# Altium schematic sheet PowerSupp.SchDoc
size A3
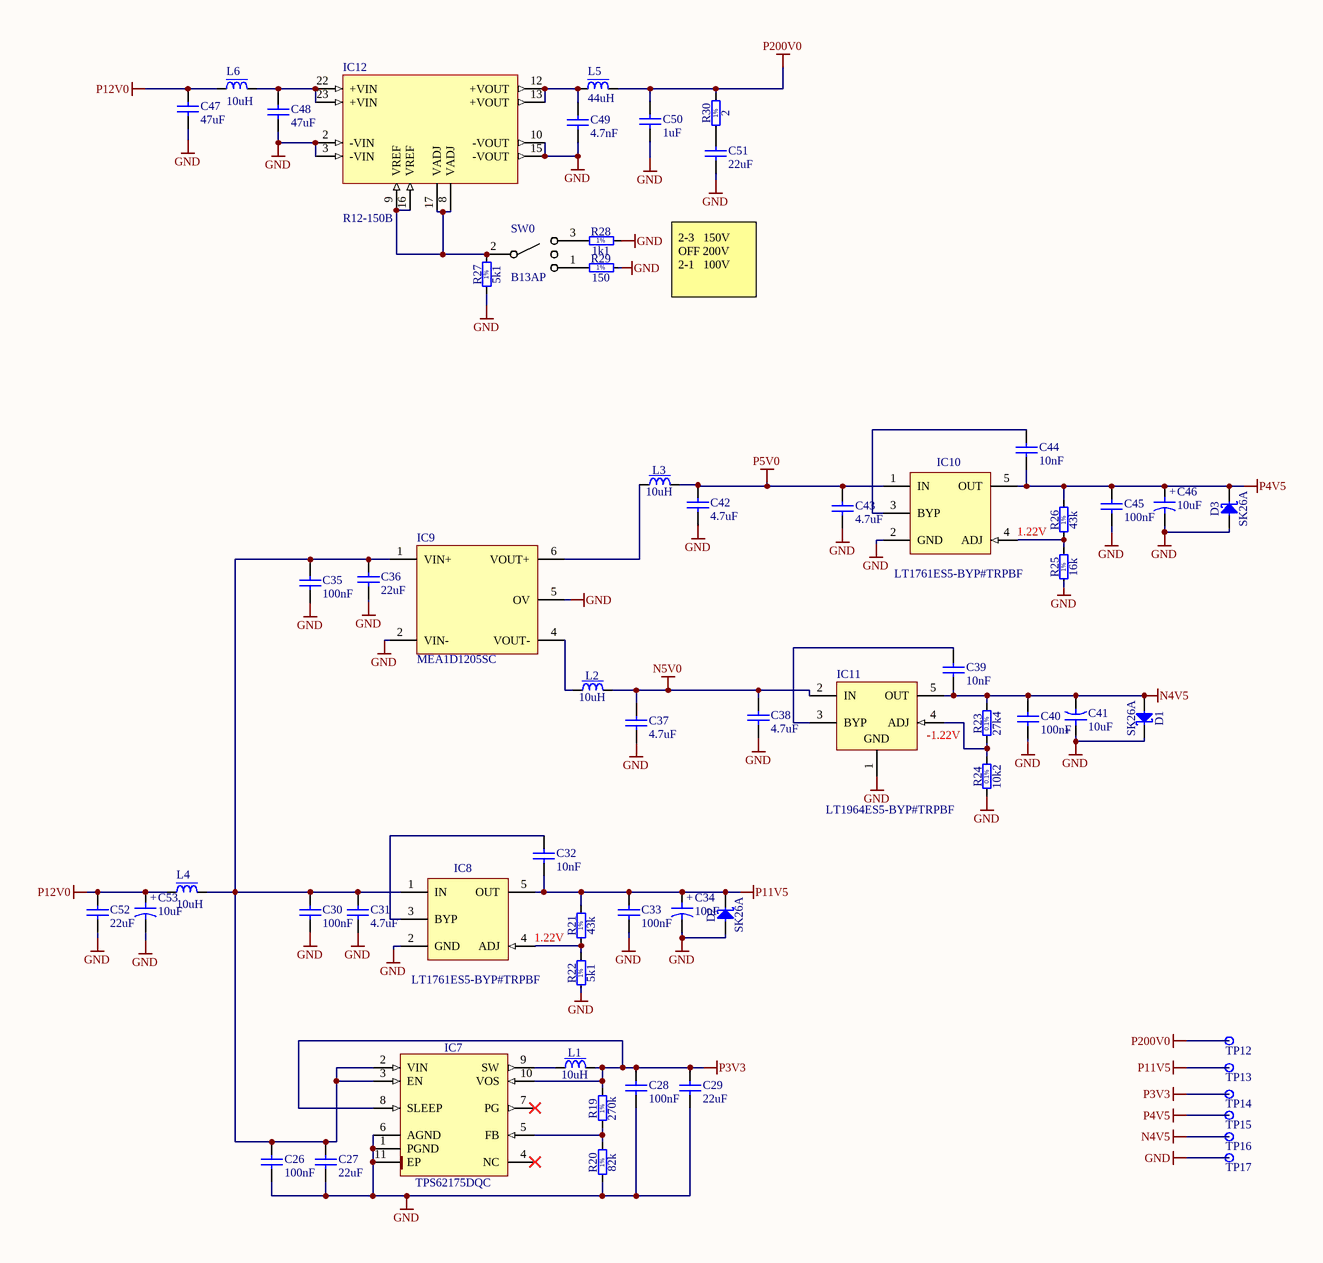
[diagram p0: PowerSupp.SchDoc]

## Parts
C26  100nF  [C0402C104K4RACTU]
C27  22uF  [GRM219R61C226ME15K]
C28  100nF  [C0402C104K4RACTU]
C29  22uF  [GRM219R61C226ME15K]
C30  100nF  [C0402C104K4RACTU]
C31  4.7uF  [C0805C475K4RACTU]
C32  10nF  [C0402C103K4RACTU]
C33  100nF  [C0402C104K4RACTU]
C34  10uF  [TCJT106M016R0200]
C35  100nF  [C0402C104K4RACTU]
C36  22uF  [GRM219R61C226ME15K]
C37  4.7uF  [C0805C475K4RACTU]
C38  4.7uF  [C0805C475K4RACTU]
C39  10nF  [C0402C103K4RACTU]
C40  100nF  [C0402C104K4RACTU]
C41  10uF  [TCJT106M016R0200]
C42  4.7uF  [C0805C475K4RACTU]
C43  4.7uF  [C0805C475K4RACTU]
C44  10nF  [C0402C103K4RACTU]
C45  100nF  [C0402C104K4RACTU]
C46  10uF  [TCJT106M016R0200]
C47  47uF  [C5750X7R1C476M230KB]
C48  47uF  [C5750X7R1C476M230KB]
C49  4.7nF  [CC0805KRX7RYBB472]
C50  1uF  [GC355XD72E105KX05L]
C51  22uF  [R60IR52205000K]
C52  22uF  [GRM219R61C226ME15K]
C53  10uF  [TCJT106M016R0200]
D1  SK26A  [DIOM5126X265N]
D2  SK26A  [DIOM5126X265N]
D3  SK26A  [DIOM5126X265N]
IC7  TPS62175DQC  [SON50P200X300X80-11N-R94X250]
IC8  LT1761ES5-BYP#TRPBF  [LT-S5-5-TSOT-23_L]
IC9  MEA1D1205SC  [MURA-SIP-5_V]
IC10  LT1761ES5-BYP#TRPBF  [LT-S5-5-TSOT-23_L]
IC11  LT1964ES5-BYP#TRPBF  [LT-S5-5-TSOT-23_L]
IC12  R12-150B  [CONV_R12-100B]
L1  10uH  [IND_MURATA-PS_8400]
L2  10uH  [IND_MURATA-PS_8400]
L3  10uH  [IND_MURATA-PS_8400]
L4  10uH  [IND_MURATA-PS_8400]
L5  44uH  [LQH44PH100MPRL]
L6  10uH  [IND_MURATA-PS_8400]
R19  270k  [RESC1608X55N]
R20  82k  [RESC1608X55N]
R21  43k  [RESC1608X55N]
R22  5k1  [RESC1608X55N]
R23  27k4  [RESC1608X55N]
R24  10k2  [RESC1608X55N]
R25  16k  [RESC1608X55N]
R26  43k  [RESC1608X55N]
R27  5k1  [RESC1608X55N]
R28  1k1  [RESC1608X55N]
R29  150  [RESC1608X55N]
R30  2  [RESC3216X65N]
SW0  B13AP  [B13AP]
TP12  Test Point  [TPS127]  (value not drawn)
TP13  Test Point  [TPS127]  (value not drawn)
TP14  Test Point  [TPS127]  (value not drawn)
TP15  Test Point  [TPS127]  (value not drawn)
TP16  Test Point  [TPS127]  (value not drawn)
TP17  Test Point  [TPS127]  (value not drawn)

## Nets
GND: C26.1 C27.1 C28.1 C29.1 C30.1 C31.1 C33.1 C34.2 C35.1 C36.1 C37.1 C38.1 C40.1 C41.1 C42.1 C43.1 C45.1 C46.2 C47.1 C48.1 C49.1 C50.1 C51.1 C52.1 C53.2 D1.1(C) D2.2(A) D3.2(A) IC7.1(PGND) IC7.6(AGND) IC7.11(EP) IC8.2(GND) IC9.2(VIN-) IC9.5(OV) IC10.2(GND) IC11.1(GND) IC12.2(-VIN) IC12.3(-VIN) IC12.10(-VOUT) IC12.15(-VOUT) R20.1 R22.1 R24.1 R25.1 R27.1 R28.2 R29.2 TP17.1
N4V5: C39.1 C40.2 C41.2 D1.2(A) IC11.5(OUT) R23.2 TP16.1
N5V0: C37.2 C38.2 IC11.2(IN) L2.2
P3V3: C28.2 C29.2 IC7.8(SLEEP) IC7.10(VOS) L1.2 R19.2 TP14.1
P4V5: C44.1 C45.2 C46.1 D3.1(C) IC10.5(OUT) R26.2 TP15.1
P5V0: C42.2 C43.2 IC10.1(IN) L3.2
P11V5: C32.1 C33.2 C34.1 D2.1(C) IC8.5(OUT) R21.2 TP13.1
P12V0: C47.2 C52.2 C53.1 L4.1 L6.1
P200V0: C50.2 L5.2 R30.2 TP12.1
NetC26_2: C26.2 C27.2 C30.2 C31.2 C35.2 C36.2 IC7.2(VIN) IC7.3(EN) IC8.1(IN) IC9.1(VIN+) L4.2
NetC32_2: C32.2 IC8.3(BYP)
NetC39_2: C39.2 IC11.3(BYP)
NetC44_2: C44.2 IC10.3(BYP)
NetC48_2: C48.2 IC12.22(+VIN) IC12.23(+VIN) L6.2
NetC49_2: C49.2 IC12.12(+VOUT) IC12.13(+VOUT) L5.1
NetC51_2: C51.2 R30.1
NetIC7_5: IC7.5(FB) R19.1 R20.2
NetIC7_9: IC7.9(SW) L1.1
NetIC8_4: IC8.4(ADJ) R21.1 R22.2
NetIC9_4: IC9.4(VOUT-) L2.1
NetIC9_6: IC9.6(VOUT+) L3.1
NetIC10_4: IC10.4(ADJ) R25.2 R26.1
NetIC11_4: IC11.4(ADJ) R23.1 R24.2
NetIC12_8: IC12.8(VADJ) IC12.9(VREF) IC12.16(VREF) IC12.17(VADJ) R27.2 SW0.2(C)
NetR28_1: R28.1 SW0.3(NC)
NetR29_1: R29.1 SW0.1(NO)

Not connected (* = marked no-connect by the designer): IC7 4(NC)* 7(PG)*

## Notes on the sheet
- 2-3   150V OFF 200V  2-1   100V
- 1.22V
- (near IC11) -1.22V
- (in symbol R0603_1K1_1%_0.1W_100PPM) 1%
- (in symbol R0603_5K1_1%_0.1W_100PPM) 1%
- (in symbol R0603_10K2_0.1%_0.063W_10PPM) 0.1%
- (in symbol R0603_16K_1%_0.1W_100PPM) 1%
- (in symbol R0603_27K4_0.1%_0.063W_10PPM) 0.1%
- (in symbol R0603_43K_1%_0.1W_100PPM) 1%
- (in symbol R0603_82K_1%_0.1W_100PPM) 1%
- (in symbol R0603_150R_1%_0.1W_100PPM) 1%
- (in symbol R0603_270K_1%_0.1W_100PPM) 1%
- (in symbol R1206_2R_1%_0.25W_200PPM) 1%
- (in symbol TCJT106M016R0200) +

## Library data of the parts
C26 C28 C30 C33 C35 C40 C45 = C0402C104K4RACTU: Capacitor; Ceramic; Cap; .100uF; Tol 10%; SMT; Vol-Rtg 16V; X7R; Tape and Reel; Manufacturer 1: KEMET; Dissipation Factor: 3.5%; Supplier 1: Digi-Key; Manufacturer Part Number 1: C0402C104K4RACTU; Stock 1: 636137; Pricing 1: 1=0,10000, 10=0,04000, 50=0,02180, 100=0,01780, 500=0,01270, 1000=0,00998, 2500=0,00908, 5000=0,00835 (USD); RoHS: Yes; Mount: Surface Mount; Case/Package: 0402; Case Code (Imperial): 0402; Case Code (Metric): 1005; Contact Plating: Tin,Matte; Min Operating Temperature: -55°C; Max Operating Temperature: 125°C; Capacitance: 100nF; Tolerance: 10%; Packaging: Tape and Reel; Voltage Rating (DC): 16V; Dielectric: X7R; Package Quantity: 10000; Voltage Rating: 16V; Termination: SMD/SMT; Length: 1mm; Height: 0.5mm; Width: 0.5mm; Depth: 0.5mm; Radiation Hardening: No; ComponentLink1URL: https://datasheet.ciiva.com/45846/docfinderpartnumberc0402c102k5ractu-45846919.pdf?src-supplier=Onlinecomponents.com; ComponentLink1Description: https://datasheet.ciiva.com/45846/docfinderpartnumberc0402c102k5ractu-45846919.pdf?src-supplier=Onlinecomponents.com; ComponentLink2URL: https://datasheet.ciiva.com/18192/getdatasheetpartid-385384-18192412.pdf?src-supplier=Verical; ComponentLink2Description: https://datasheet.ciiva.com/18192/getdatasheetpartid-385384-18192412.pdf?src-supplier=Verical; Supplier Part Number 1: 399-3521-1-ND
C27 C29 C36 C52 = GRM219R61C226ME15K: CAP CER 22uF 16V X5R 20% SMD 0805 85°C Embossed T/R; Manufacturer 1: Murata; Supplier 1: Digi-Key; Manufacturer Part Number 1: GRM219R61C226ME15K; Stock 1: 9158; Pricing 1: 1=0,46000, 10=0,32500, 50=0,24560, 100=0,21400, 500=0,15852, 1000=0,13473, 2500=0,12681, 5000=0,11888 (USD); RoHS: No; Voltage Rating (DC): 16V; Dielectric: X5R; Tolerance: 20%; Capacitance: 22uF; Length: 2mm; Width: 1.25mm; Thickness: 850um; Supplier Part Number 1: 490-GRM219R61C226ME15KCT-ND
C31 C37 C38 C42 C43 = C0805C475K4RACTU: CAP CER 4.7uF 16V X7R 10% Pad SMD 0805 125C T/R; Manufacturer 1: KEMET; Dielectric Material: Ceramic; Dissipation Factor: 5%; Supplier 1: Digi-Key; Manufacturer Part Number 1: C0805C475K4RACTU; Stock 1: 75020; Pricing 1: 1=0,25000, 10=0,16900, 50=0,11280, 100=0,09590, 500=0,06766, 1000=0,05921 (USD); RoHS: Yes; Mount: Surface Mount; Case/Package: 0805; Case Code (Metric): 2012; Case Code (Imperial): 0805; Min Operating Temperature: -55°C; Max Operating Temperature: 125°C; Packaging: Tape and Reel; Capacitance: 4.7uF; Tolerance: 10%; Voltage Rating: 16V; Package Quantity: 1; Voltage Rating (DC): 16V; Dielectric: X7R; Termination: SMD/SMT; Voltage: 16V; Length: 2mm; Height: 1.25mm; Width: 0.049inch; Thickness: 0.055inch; Depth: 1.25mm; REACH SVHC: No SVHC; ComponentLink1URL: https://datasheet.ciiva.com/5408/kem-c1002-x7r-smd-5408584.pdf?src-supplier=Mouser; ComponentLink1Description: https://datasheet.ciiva.com/5408/kem-c1002-x7r-smd-5408584.pdf?src-supplier=Mouser; ComponentLink2URL: https://datasheet.ciiva.com/28682/1851736-28682348.pdf?src-supplier=Element14; ComponentLink2Description: https://datasheet.ciiva.com/28682/1851736-28682348.pdf?src-supplier=Element14; Supplier Part Number 1: 399-7415-1-ND
C32 C39 C44 = C0402C103K4RACTU: CAP CER 10nF 16V X7R 10% SMD 0402 125C Paper T/R; Manufacturer 1: KEMET; Dielectric Material: Ceramic; Dissipation Factor: 3.5%; Supplier 1: Digi-Key; Manufacturer Part Number 1: C0402C103K4RACTU; Stock 1: 1553319; Pricing 1: 1=0,10000, 10=0,02700, 50=0,01460, 100=0,01190, 500=0,00848, 1000=0,00666, 2500=0,00605, 5000=0,00557 (USD); RoHS: Yes; Mount: Surface Mount,PCB; Case/Package: 0402; Number of Pins: 2; Case Code (Metric): 1005; Case Code (Imperial): 0402; Contact Plating: Tin,Matte; Min Operating Temperature: -55°C; Max Operating Temperature: 125°C; Package Quantity: 1; Capacitance: 10nF; Voltage Rating: 16V; Tolerance: 10%; Packaging: Tape and Reel; Voltage Rating (DC): 16V; Dielectric: X7R; Termination: SMD/SMT; Voltage: 16V; Length: 1mm; Height: 0.5mm; Width: 0.02inch; Lead Pitch: 0.3mm; Thickness: 0.022inch; Depth: 0.5mm; Radiation Hardening: No; REACH SVHC: No SVHC; ComponentLink1URL: https://datasheet.ciiva.com/14595/70095383-14595321.pdf?src-supplier=Allied+Electronics; ComponentLink1Description: https://datasheet.ciiva.com/14595/70095383-14595321.pdf?src-supplier=Allied+Electronics; ComponentLink2URL: https://datasheet.ciiva.com/7747/kem-c1002-x7r-smd-7747614.pdf?src-supplier=Element14; ComponentLink2Description: https://datasheet.ciiva.com/7747/kem-c1002-x7r-smd-7747614.pdf?src-supplier=Element14; Supplier Part Number 1: 399-1038-1-ND
C34 C41 C46 C53 = TCJT106M016R0200: CAP TANT POLY 10UF 16V 1210; Manufacturer 1: Kyocera AVX; Tolerance: 20%; ESR (Equivalent Series Resistance): 200mR; Leakage Current: 16uA; Dissipation Factor: 6%; Supplier 1: Digi-Key; Manufacturer Part Number 1: TCJT106M016R0200; Stock 1: 1486; Pricing 1: 1=0,85000, 10=0,62700, 50=0,50140, 100=0,42980, 500=0,34026, 1000=0,28653 (USD); RoHS: Yes; Mount: Surface Mount; Case/Package: 1210; Case Code (Imperial): 1210; Case Code (Metric): 3528; Min Operating Temperature: -55°C; Max Operating Temperature: 125°C; Capacitance: 10uF; Termination: SMD/SMT; Voltage: 16V; Packaging: Tape and Reel; Package Quantity: 2500; Voltage Rating (DC): 16V; Voltage Rating: 16V; Length: 3.5mm; Height: 1.2mm; Depth: 2.8mm; Height - Seated (Max): 0.047inch; Width: 2.8mm; Radiation Hardening: No; ComponentLink1URL: https://datasheet.ciiva.com/11793/0900766b80eff593-11793120.pdf?src-supplier=RSComponents; ComponentLink1Description: https://datasheet.ciiva.com/11793/0900766b80eff593-11793120.pdf?src-supplier=RSComponents; ComponentLink2URL: https://datasheet.ciiva.com/6238/tcj-6238575.pdf?src-supplier=Digi-Key; ComponentLink2Description: https://datasheet.ciiva.com/6238/tcj-6238575.pdf?src-supplier=Digi-Key; ComponentLink3URL: https://datasheet.ciiva.com/11231/tcj-11231109.pdf?src-supplier=Avnet; ComponentLink3Description: https://datasheet.ciiva.com/11231/tcj-11231109.pdf?src-supplier=Avnet; Supplier Part Number 1: 478-11587-1-ND
C47 C48 = C5750X7R1C476M230KB: CAP CER 47 F, 16 V,  20%, X7R, C Series, 2220 [5650 Metric]; Manufacturer 1: TDK; Dielectric Material: Ceramic; Voltage Rating (DC): 16V; Supplier 1: Digi-Key; Manufacturer Part Number 1: C5750X7R1C476M230KB; Stock 1: 2641; Pricing 1: 1=2,47000, 10=1,99700, 50=1,74240, 100=1,52460 (USD); RoHS: Yes; Mount: Surface Mount; Case/Package: 2220; Number of Pins: 2; Weight: 0.016932oz; Case Code (Imperial): 2220; Case Code (Metric): 5750; Min Operating Temperature: -55°C; Max Operating Temperature: 125°C; Dielectric: X7R; Tolerance: 20%; Capacitance: 47uF; Termination: SMD/SMT; Packaging: Tape and Reel; Package Quantity: 1; Voltage Rating: 16V; Composition: Ceramic; Voltage: 16V; Length: 5.7mm; Height: 2.3mm; Depth: 5mm; Thickness: 0.098inch; Width: 5mm; Radiation Hardening: No; Lead Free: Lead Free; REACH SVHC: No SVHC; ComponentLink1URL: https://datasheet.ciiva.com/24216/c5750x7r1c476m230kb-265643-24216054.pdf?src-supplier=Mouser; ComponentLink1Description: https://datasheet.ciiva.com/24216/c5750x7r1c476m230kb-265643-24216054.pdf?src-supplier=Mouser; ComponentLink2URL: https://datasheet.ciiva.com/11788/0900766b80c1bb00-11788334.pdf?src-supplier=RSComponents; ComponentLink2Description: https://datasheet.ciiva.com/11788/0900766b80c1bb00-11788334.pdf?src-supplier=RSComponents; ComponentLink3URL: https://datasheet.ciiva.com/6283/tdkmlcccaprange-6283815.pdf?src-supplier=Digi-Key; ComponentLink3Description: https://datasheet.ciiva.com/6283/tdkmlcccaprange-6283815.pdf?src-supplier=Digi-Key; ComponentLink4URL: https://datasheet.ciiva.com/28563/1571323-28563291.pdf?src-supplier=Element14; ComponentLink4Description: https://datasheet.ciiva.com/28563/1571323-28563291.pdf?src-supplier=Element14; ComponentLink5URL: https://datasheet.ciiva.com/6283/tdkmlcccaprange-6283820.pdf?src-supplier=Digi-Key; ComponentLink5Description: https://datasheet.ciiva.com/6283/tdkmlcccaprange-6283820.pdf?src-supplier=Digi-Key; ComponentLink6URL: https://datasheet.ciiva.com/17487/e412-c-17487189.pdf?src-supplier=Avnet+Europe; ComponentLink6Description: https://datasheet.ciiva.com/17487/e412-c-17487189.pdf?src-supplier=Avnet+Europe; ComponentLink7URL: https://datasheet.ciiva.com/6283/tdkmlcccaprange-6283817.pdf?src-supplier=Digi-Key; ComponentLink7Description: https://datasheet.ciiva.com/6283/tdkmlcccaprange-6283817.pdf?src-supplier=Digi-Key; ComponentLink8URL: https://datasheet.ciiva.com/16427/e412-c-16427903.pdf?src-supplier=Future+Electronics; ComponentLink8Description: https://datasheet.ciiva.com/16427/e412-c-16427903.pdf?src-supplier=Future+Electronics; Supplier Part Number 1: 445-3496-1-ND
C49 = CC0805KRX7RYBB472: CAP CER 4700PF 250V X7R 0805; Manufacturer 1: Yageo; Tolerance: 10%; Supplier 1: Digi-Key; Manufacturer Part Number 1: CC0805KRX7RYBB472; Stock 1: 29715; Pricing 1: 1=0,19000, 10=0,13300, 50=0,07560, 100=0,06270, 500=0,04396, 1000=0,03639 (USD); RoHS: Yes; Mount: Surface Mount; Case/Package: 0805; Weight: 0.000194oz; Case Code (Imperial): 0805; Case Code (Metric): 2012; Min Operating Temperature: -55°C; Max Operating Temperature: 125°C; Capacitance: 4.7nF; Dielectric: X7R; Termination: SMD/SMT; Composition: Ceramic; Packaging: Tape and Reel; Voltage Rating: 250V; Voltage Rating (DC): 250V; Length: 2mm; Height: 0.85mm; Depth: 1.25mm; Thickness: 0.037inch; Width: 0.049inch; Radiation Hardening: No; Lead Free: Lead Free; REACH SVHC: Unknown; ComponentLink1URL: http://www.farnell.com/datasheets/2213335.pdf?src-supplier=Farnell; ComponentLink1Description: http://www.farnell.com/datasheets/2213335.pdf?src-supplier=Farnell; ComponentLink2URL: http://www.mouser.com/ds/2/447/Yageo_UPY-GP_NP0_16V-to-50V_9-358835.pdf?src-supplier=Mouser; ComponentLink2Description: http://www.mouser.com/ds/2/447/Yageo_UPY-GP_NP0_16V-to-50V_9-358835.pdf?src-supplier=Mouser; ComponentLink3URL: http://www.farnell.com/datasheets/1919308.pdf?src-supplier=Farnell; ComponentLink3Description: http://www.farnell.com/datasheets/1919308.pdf?src-supplier=Farnell; ComponentLink4URL: http://components.arrow.com/part/dataview/0323_00786513?src-supplier=Arrow+Europe; ComponentLink4Description: http://components.arrow.com/part/dataview/0323_00786513?src-supplier=Arrow+Europe; ComponentLink5URL: http://www.yageo.com/documents/recent/UPY-NP0X7R_MV_100-to-630V_9.pdf?src-supplier=Avnet; ComponentLink5Description: http://www.yageo.com/documents/recent/UPY-NP0X7R_MV_100-to-630V_9.pdf?src-supplier=Avnet; ComponentLink6URL: http://www.yageo.com/documents/recent/UPY-NP0X7R_MV_100-to-630V_21.pdf?src-supplier=Digi-Key; ComponentLink6Description: http://www.yageo.com/documents/recent/UPY-NP0X7R_MV_100-to-630V_21.pdf?src-supplier=Digi-Key; ComponentLink7URL: http://www.yageo.com/documents/recent/UPY-NP0X7R_MV_100-to-630V_9.pdf?src-supplier=Avnet+Europe; ComponentLink7Description: http://www.yageo.com/documents/recent/UPY-NP0X7R_MV_100-to-630V_9.pdf?src-supplier=Avnet+Europe; ComponentLink8URL: http://www.farnell.com/datasheets/2167074.pdf?src-supplier=Element14; ComponentLink8Description: http://www.farnell.com/datasheets/2167074.pdf?src-supplier=Element14; ComponentLink9URL: http://www.yageo.com/documents/recent/UPY-NP0X7R_MV_100-to-630V_9.pdf?src-supplier=Future+Electronics; ComponentLink9Description: http://www.yageo.com/documents/recent/UPY-NP0X7R_MV_100-to-630V_9.pdf?src-supplier=Future+Electronics; ComponentLink10URL: http://www.yageo.com/documents/recent/UPY-NP0X7R_MV_100-to-630V_18.pdf?src-supplier=Digi-Key; ComponentLink10Description: http://www.yageo.com/documents/recent/UPY-NP0X7R_MV_100-to-630V_18.pdf?src-supplier=Digi-Key; Supplier Part Number 1: 311-3395-1-ND
C50 = GC355XD72E105KX05L: CAP CER 1UF 250V X7T 2220; Manufacturer 1: Murata; Tolerance: 10%; Supplier 1: Digi-Key; Manufacturer Part Number 1: GC355XD72E105KX05L; Stock 1: 1214; Pricing 1: 1=3,72000, 10=3,00800, 50=2,62500, 100=2,29680 (USD); RoHS: Yes; Mount: Surface Mount; Case/Package: 2220; Case Code (Imperial): 2220; Case Code (Metric): 5750; Min Operating Temperature: -55°C; Max Operating Temperature: 125°C; Packaging: Tape and Reel; Capacitance: 1uF; Voltage Rating: 250V; Length: 0.224inch; Width: 0.197inch; Thickness: 0.118inch; Ratings: AEC-Q200; ComponentLink1URL: http://www.murata.com/~/media/webrenewal/support/library/catalog/products/capacitor/mlcc/c03e.ashx?src-supplier=Digi-Key; ComponentLink1Description: http://www.murata.com/~/media/webrenewal/support/library/catalog/products/capacitor/mlcc/c03e.ashx?src-supplier=Digi-Key; ComponentLink2URL: http://search.murata.co.jp/Ceramy/image/img/A01X/partnumbering_e_02.pdf?src-supplier=Digi-Key; ComponentLink2Description: http://search.murata.co.jp/Ceramy/image/img/A01X/partnumbering_e_02.pdf?src-supplier=Digi-Key; Supplier Part Number 1: 490-14017-1-ND
C51 = R60IR52205000K: CAP FILM, PET, 22UF, 250V, RADIAL; Manufacturer_Name: Kemet; Dielectric Material: Polyester; Tolerance: 10%; Datasheet Link: https://api.kemet.com/component-edge/download/datasheet/R60IR52205000K.pdf; Height: 33.1mm; Manufacturer_Part_Number: R60IR52205000K; Supplier 1: Mouser; Manufacturer 1: KEMET; Manufacturer Part Number 1: R60IR52205000K; Stock 1: 387; Pricing 1: 1=6,46000, 10=5,74000, 50=5,08000, 100=4,64000, 250=4,21000, 500=3,99000 (USD); RoHS: Yes; Case/Package: Radial; Min Operating Temperature: -55°C; Max Operating Temperature: 105°C; Dielectric: PET; Voltage Rating (DC): 250V; Capacitance: 22uF; Voltage Rating: 250V; Packaging: Cut Tape; Lead Pitch: 27.5mm; REACH SVHC: No SVHC; ComponentLink1URL: https://datasheet.ciiva.com/46436/1848874-46436261.pdf?src-supplier=Element14; ComponentLink1Description: https://datasheet.ciiva.com/46436/1848874-46436261.pdf?src-supplier=Element14; Supplier Part Number 1: 80-60IR52205000K
D1-D3 = SK26A: Schottky Diode; Part Description: 2A, 60V Surface Mount Schottky Barrier Rectifier; Manufacturer: TAIWAN SEMICONDUCTOR; Voltage: 60V; Power: 2A; PressFit: No; Bonding: No; Part Number: SK26A; Component Kind: Standard; Component Type: Standard; Device: SK26A; PackageDescription: DO-214-AC/SMA Molded Diode, 2-Leads, Body 5.1x2.6mm, IPC Medium Density; Manufacturer Part Number: SK26A; Pin Count: 2; Case: DO-214AC; Mounted: Yes; Socket: No; SMD: Yes; Sense: No; ComponentHeight: 2.5mm; HelpURL: \\cern.ch\dfs\Applications\Altium\Datasheets\SK26A.pdf; Author: CERN DEM JMW; CreateDate: 07.08.2015; LatestRevisionDate: 07.08.2015
IC7 = TPS62175DQC: 4.75-28VDC to 1-6VDC, 500mA Step-Down Converter With Sleep Mode; Manufacturer: TEXAS INSTRUMENTS; PressFit: No; Bonding: No; Part Number: TPS62175DQC; Component Kind: Standard; Component Type: Standard; Device: TPS62175DQC; PackageDescription: SON, 10-Leads, Body 2x3mm, Pitch 0.5mm, Thermal Pad 0.94x2.5mm, IPC Medium Density; Part Description: 4.75-28VDC to 1-6VDC, 500mA Step-Down Converter With Sleep Mode; Manufacturer Part Number: TPS62175DQC; Pin Count: 11; Case: SON10; Mounted: Yes; Socket: No; SMD: Yes; Sense: No; ComponentHeight: 0.8mm; HelpURL: \\cern.ch\dfs\Applications\Altium\Datasheets\TPS62175DQC.pdf; Author: CERN DEM JMW; CreateDate: 11.08.2015; LatestRevisionDate: 11.08.2015
IC8 IC10 = LT1761ES5-BYP#TRPBF: LDO Regulator Pos 1.22V to 20V 0.1A 5-Pin TSOT-23 T/R; Manufacturer 1: Analog Devices / Linear Technology; Output Current: 100mA; Operating Supply Current: 20uA; Power Supply Rejection Ratio (PSRR): 65dB; Dropout Voltage: 300mV; Number of Outputs: 1; Min Input Voltage: 1.8V; Polarity: Positive; Min Current Limit: 110mA; Supplier 1: Mouser; Manufacturer Part Number 1: LT1761ES5-BYP#TRPBF; Stock 1: 3; Pricing 1: 1=2,36000, 25=1,29000, 100=1,20000, 1000=1,20000, 2500=1,16000, 5000=1,13000 (USD); RoHS: Yes; Case/Package: SOT-23-5; Number of Pins: 5; Min Operating Temperature: -40°C; Max Operating Temperature: 125°C; Output Voltage: 20V; Max Output Voltage: 20V; Min Output Voltage: 1.22V; Max Input Voltage: 20V; Package Quantity: 2500; Packaging: Tape and Reel; Number of Regulators: 1; Lead Free: Lead Free; ComponentLink1URL: https://datasheet.ciiva.com/26905/lt1761es5-byp-trpbf-26905866.pdf?src-supplier=IIIC; ComponentLink1Description: https://datasheet.ciiva.com/26905/lt1761es5-byp-trpbf-26905866.pdf?src-supplier=IIIC; ComponentLink2URL: https://datasheet.ciiva.com/29570/2732-29570154.pdf?src-supplier=Digi-Key; ComponentLink2Description: https://datasheet.ciiva.com/29570/2732-29570154.pdf?src-supplier=Digi-Key; ComponentLink3URL: https://datasheet.ciiva.com/29570/2732-29570156.pdf?src-supplier=Digi-Key; ComponentLink3Description: https://datasheet.ciiva.com/29570/2732-29570156.pdf?src-supplier=Digi-Key; ComponentLink4URL: https://datasheet.ciiva.com/29570/2732-29570155.pdf?src-supplier=Digi-Key; ComponentLink4Description: https://datasheet.ciiva.com/29570/2732-29570155.pdf?src-supplier=Digi-Key; Supplier Part Number 1: 584-1761ES5-BYPTRPBF
IC9 = MEA1D1205SC: Module DC-DC 2-OUT 5V/-5V 0.1A/-0.1A 1W 5-Pin SIP Tube; Manufacturer 1: Murata; Number of Outputs: 2; Max Input Voltage (DC): 13.2V; Min Input Voltage (DC): 10.8V; Nominal Output Voltage: -5V; Max Output Current: 100mA; Efficiency: 85%; Voltage - Output 1: 5V; Isolation Voltage: 1kV; Nominal Input Voltage: 12V; Isolation: Isolated; Supplier 1: Mouser; Manufacturer Part Number 1: MEA1D1205SC; Stock 1: 75; Pricing 1: 1=5,39000, 5=5,33000, 10=5,25000, 25=4,96000, 50=4,84000, 100=4,60000 (USD); RoHS: Yes; Mount: Through Hole; Case/Package: SIP; Number of Pins: 5; Min Operating Temperature: -40°C; Max Operating Temperature: 85°C; Output Power: 1W; Packaging: Rail/Tube; Package Quantity: 25; Max Power Dissipation: 1W; Max Input Voltage: 13.2V; Min Input Voltage: 10.8V; Voltage - Output 2: -5V; Output Current: 100mA; Output Voltage: 5V; Current - Output 1: 100mA; Current - Output 2: 100mA; Max Output Power: 1W; Length: 19.65mm; Height: 0.4inch; Depth: 6.15mm; Width: 0.24inch; Radiation Hardening: No; REACH SVHC: No SVHC; ComponentLink1URL: https://datasheet.ciiva.com/11837/0900766b80dc6287-11837761.pdf?src-supplier=RSComponents; ComponentLink1Description: https://datasheet.ciiva.com/11837/0900766b80dc6287-11837761.pdf?src-supplier=RSComponents; ComponentLink2URL: https://datasheet.ciiva.com/26329/158005-da-01-en-dc-dc-wandler-mea1d1205sc-mps-26329995.pdf?src-supplier=Conrad; ComponentLink2Description: https://datasheet.ciiva.com/26329/158005-da-01-en-dc-dc-wandler-mea1d1205sc-mps-26329995.pdf?src-supplier=Conrad; ComponentLink3URL: https://datasheet.ciiva.com/17329/kdc-mea-17329820.pdf?src-supplier=Avnet+Europe; ComponentLink3Description: https://datasheet.ciiva.com/17329/kdc-mea-17329820.pdf?src-supplier=Avnet+Europe; ComponentLink4URL: https://datasheet.ciiva.com/8218/kdc-mea-8218205.pdf?src-supplier=Avnet; ComponentLink4Description: https://datasheet.ciiva.com/8218/kdc-mea-8218205.pdf?src-supplier=Avnet; Supplier Part Number 1: 580-MEA1D1205SC
IC11 = LT1964ES5-BYP#TRPBF: IC REG LDO NEG ADJ 0.2A TSOT23-5; Manufacturer 1: Analog Devices / Linear Technology; Dropout Voltage: 340mV; Number of Outputs: 1; Max Input Voltage: -1.9V; Min Input Voltage: -20V; Output Current: 200mA; Operating Supply Current: 30uA; Power Supply Rejection Ratio (PSRR): 54dB; Polarity: Negative; Min Current Limit: 220mA; Supplier 1: Digi-Key; Manufacturer Part Number 1: LT1964ES5-BYP#TRPBF; Stock 1: 2250; Pricing 1: 1=3,51000, 25=2,02000, 100=1,80900 (USD); RoHS: Yes; Case/Package: SOT-23-5; Number of Pins: 5; Min Operating Temperature: -40°C; Max Operating Temperature: 125°C; Output Voltage: -20V; Packaging: Tape and Reel; Number of Regulators: 1; Package Quantity: 2500; Lead Free: Lead Free; ComponentLink1URL: https://datasheet.ciiva.com/26906/lt1964es5-byp-trpbf-26906996.pdf?src-supplier=IIIC; ComponentLink1Description: https://datasheet.ciiva.com/26906/lt1964es5-byp-trpbf-26906996.pdf?src-supplier=IIIC; ComponentLink2URL: https://datasheet.ciiva.com/2058/1258-2058212.pdf?src-supplier=Digi-Key; ComponentLink2Description: https://datasheet.ciiva.com/2058/1258-2058212.pdf?src-supplier=Digi-Key; Supplier Part Number 1: LT1964ES5-BYP#TRPBFCT-ND
IC12 = R12-150B: DC DC CONVERTER 95-210V 5W; Manufacturer 1: Recom; Max Input Voltage (DC): 14V; Max Output Voltage: 200V; Isolation: Isolated; Number of Outputs: 1; Efficiency: 82%; Min Input Voltage: 10V; Output Voltage: 210V; Output Current: 50mA; Nominal Input Voltage: 12V; Nominal Output Voltage: 150V; Isolation Voltage: 3kV; Supplier 1: Digi-Key; Manufacturer Part Number 1: R12-150B; Stock 1: 470; Pricing 1: 1=42,43000, 5=42,10000, 10=41,76900, 25=40,44320, 50=38,45400, 100=35,80200, 250=35,27160 (USD); RoHS: Yes; Mount: Through Hole; Case/Package: DIP; Number of Pins: 12; Weight: 12g; Min Operating Temperature: -40°C; Max Operating Temperature: 85°C; Packaging: Rail/Tube; Package Quantity: 15; Max Power Dissipation: 5W; Max Output Power: 5W; Features: SCP; Output Power: 5W; Max Input Voltage: 14V; Min Input Voltage (DC): 10V; Max Output Current: 50mA; Voltage - Output 1: 210V; Current - Output 1: 50mA; Length: 31.8mm; Height: 9.4mm; Width: 20.03mm; Depth: 31.8mm; REACH SVHC: No SVHC; Lead Free: Lead Free; ComponentLink1URL: https://datasheet.ciiva.com/11837/0900766b80f8dc4c-11837266.pdf?src-supplier=RSComponents; ComponentLink1Description: https://datasheet.ciiva.com/11837/0900766b80f8dc4c-11837266.pdf?src-supplier=RSComponents; ComponentLink2URL: https://datasheet.ciiva.com/46416/1842293-46416248.pdf?src-supplier=Element14; ComponentLink2Description: https://datasheet.ciiva.com/46416/1842293-46416248.pdf?src-supplier=Element14; ComponentLink3URL: https://datasheet.ciiva.com/24142/rxx-b-220108-24142117.pdf?src-supplier=Mouser; ComponentLink3Description: https://datasheet.ciiva.com/24142/rxx-b-220108-24142117.pdf?src-supplier=Mouser; Supplier Part Number 1: 945-2053-5-ND
L1-L4 L6 = IND_10UH_10%_MURATA-PS_8400: Inductor With Core; Part Description: Miniature Surface Mount Power Inductor (8400 Series); Manufacturer: MURATA POWER SOLUTIONS; Manufacturer Part Number: 84103C; Power: 950mA; Resistance: 0.24R; Tolerance: ±10%; Part Number: IND_10UH_10%_MURATA-PS_8400; Component Kind: Standard; Component Type: Standard; Pin Count: 2; Value: 10uH; Status: None; Mounted: Yes; Socket: No; SMD: Yes; Sense: No; ComponentHeight: 2.9mm; HelpURL: \\cern.ch\dfs\Applications\Altium\Datasheets\IND_MURATA-PS_8400.pdf; Author: CERN DEM JLC; CreateDate: 02.07.2012; LatestRevisionDate: 02.07.2012
L5 = LQH44PH470MPRL: Manufacturer 1: Murata; Supplier 1: Digi-Key; Manufacturer Part Number 1: LQH44PH470MPRL; Stock 1: 1000; Pricing 1: 1=0,39000, 10=0,34500, 100=0,23720, 500=0,20268 (USD); RoHS: No; Supplier Part Number 1: 490-LQH44PH470MPRLCT-ND; Supplier 2: Mouser; Manufacturer 2: Murata; Manufacturer Part Number 2: LQH44PH470MPRL; Stock 2: 1706; Pricing 2: 1=0,38000, 10=0,34400, 100=0,23700, 500=0,20200, 1000=0,15500, 2000=0,12700 (USD); Supplier Part Number 2: 81-LQH44PH470MPRL
R19 = R0603_270K_1%_0.1W_100PPM: Resistor - 1%; Part Description: General Purpose Thick Film Chip Resistor; Manufacturer: GENERIC; Manufacturer1 Part Number: NRC06F2703TRF; Power: 0.1W; TC: ±100ppm/°C; PressFit: No; Part Number: R0603_270K_1%_0.1W_100PPM; Component Kind: Standard; Component Type: Standard; Pin Count: 2; Value: 270k; Status: Preferred; Tolerance: ±1%; Manufacturer Part Number: R0603_270K_1%_0.1W_100PPM; Case: 0603; Mounted: Yes; Sense: No; Socket: No; SMD: Yes; Manufacturer1 Example: NIC COMPONENT; Manufacturer1 ComponentHeight: 0.55mm; HelpURL: \\cern.ch\dfs\Applications\Altium\Datasheets\R0603_NIC_NRC.pdf; Author: CERN DEM JLC; CreateDate: 03.12.2007; LatestRevisionDate: 13.03.2008
R20 = R0603_82K_1%_0.1W_100PPM: Resistor - 1%; Part Description: General Purpose Thick Film Chip Resistor; Manufacturer: GENERIC; Manufacturer1 Part Number: NRC06F8202TRF; Power: 0.1W; TC: ±100ppm/°C; PressFit: No; Part Number: R0603_82K_1%_0.1W_100PPM; Component Kind: Standard; Component Type: Standard; Pin Count: 2; Value: 82k; Status: Preferred; Tolerance: ±1%; Manufacturer Part Number: R0603_82K_1%_0.1W_100PPM; Case: 0603; Mounted: Yes; Sense: No; Socket: No; SMD: Yes; Manufacturer1 Example: NIC COMPONENT; Manufacturer1 ComponentHeight: 0.55mm; HelpURL: \\cern.ch\dfs\Applications\Altium\Datasheets\R0603_NIC_NRC.pdf; Author: CERN DEM JLC; CreateDate: 03.12.2007; LatestRevisionDate: 13.03.2008
R21 R26 = R0603_43K_1%_0.1W_100PPM: Resistor - 1%; Part Description: General Purpose Thick Film Chip Resistor; Manufacturer: GENERIC; Manufacturer1 Part Number: NRC06F4302TRF; Power: 0.1W; TC: ±100ppm/°C; PressFit: No; Part Number: R0603_43K_1%_0.1W_100PPM; Component Kind: Standard; Component Type: Standard; Pin Count: 2; Value: 43k; Status: Preferred; Tolerance: ±1%; Manufacturer Part Number: R0603_43K_1%_0.1W_100PPM; Case: 0603; Mounted: Yes; Sense: No; Socket: No; SMD: Yes; Manufacturer1 Example: NIC COMPONENT; Manufacturer1 ComponentHeight: 0.55mm; HelpURL: \\cern.ch\dfs\Applications\Altium\Datasheets\R0603_NIC_NRC.pdf; Author: CERN DEM JLC; CreateDate: 03.12.2007; LatestRevisionDate: 13.03.2008
R22 R27 = R0603_5K1_1%_0.1W_100PPM: Resistor - 1%; Part Description: General Purpose Thick Film Chip Resistor; Manufacturer: GENERIC; Manufacturer1 Part Number: NRC06F5101TRF; Power: 0.1W; TC: ±100ppm/°C; PressFit: No; Part Number: R0603_5K1_1%_0.1W_100PPM; Component Kind: Standard; Component Type: Standard; Pin Count: 2; Value: 5k1; Status: Preferred; Tolerance: ±1%; Manufacturer Part Number: R0603_5K1_1%_0.1W_100PPM; Case: 0603; Mounted: Yes; Sense: No; Socket: No; SMD: Yes; Manufacturer1 Example: NIC COMPONENT; Manufacturer1 ComponentHeight: 0.55mm; HelpURL: \\cern.ch\dfs\Applications\Altium\Datasheets\R0603_NIC_NRC.pdf; Author: CERN DEM JLC; CreateDate: 03.12.2007; LatestRevisionDate: 13.03.2008
R23 = R0603_27K4_0.1%_0.063W_10PPM: Resistor - 0.1%; Part Description: Thin Film Chip Resistor; Manufacturer: GENERIC; Manufacturer1 Part Number: RN73C1J27K4BTDF; Power: 0.063W; TC: ±10ppm; PressFit: No; Part Number: R0603_27K4_0.1%_0.063W_10PPM; Component Kind: Standard; Component Type: Standard; Pin Count: 2; Value: 27k4; Status: Not Recommended; Tolerance: ±0.1%; Manufacturer Part Number: R0603_27K4_0.1%_0.063W_10PPM; Case: 0603; Mounted: Yes; Sense: No; Socket: No; SMD: Yes; Manufacturer1 Example: TYCO HOLSWORTHY; Manufacturer1 ComponentHeight: 0.5mm; HelpURL: \\cern.ch\dfs\Applications\Altium\Datasheets\R0603_Tyco_RN73.pdf; Author: CERN DEM JLC; CreateDate: 03.12.2007; LatestRevisionDate: 13.03.2008
R24 = R0603_10K2_0.1%_0.063W_10PPM: Resistor - 0.1%; Part Description: Thin Film Chip Resistor; Manufacturer: GENERIC; Manufacturer1 Part Number: RN73C1J10K2BTDF; Power: 0.063W; TC: ±10ppm; PressFit: No; Part Number: R0603_10K2_0.1%_0.063W_10PPM; Component Kind: Standard; Component Type: Standard; Pin Count: 2; Value: 10k2; Status: Not Recommended; Tolerance: ±0.1%; Manufacturer Part Number: R0603_10K2_0.1%_0.063W_10PPM; Case: 0603; Mounted: Yes; Sense: No; Socket: No; SMD: Yes; Manufacturer1 Example: TYCO HOLSWORTHY; Manufacturer1 ComponentHeight: 0.5mm; HelpURL: \\cern.ch\dfs\Applications\Altium\Datasheets\R0603_Tyco_RN73.pdf; Author: CERN DEM JLC; CreateDate: 03.12.2007; LatestRevisionDate: 13.03.2008
R25 = R0603_16K_1%_0.1W_100PPM: Resistor - 1%; Part Description: General Purpose Thick Film Chip Resistor; Manufacturer: GENERIC; Manufacturer1 Part Number: NRC06F1602TRF; Power: 0.1W; TC: ±100ppm/°C; PressFit: No; Part Number: R0603_16K_1%_0.1W_100PPM; Component Kind: Standard; Component Type: Standard; Pin Count: 2; Value: 16k; Status: Preferred; Tolerance: ±1%; Manufacturer Part Number: R0603_16K_1%_0.1W_100PPM; Case: 0603; Mounted: Yes; Sense: No; Socket: No; SMD: Yes; Manufacturer1 Example: NIC COMPONENT; Manufacturer1 ComponentHeight: 0.55mm; HelpURL: \\cern.ch\dfs\Applications\Altium\Datasheets\R0603_NIC_NRC.pdf; Author: CERN DEM JLC; CreateDate: 03.12.2007; LatestRevisionDate: 13.03.2008
R28 = R0603_1K1_1%_0.1W_100PPM: Resistor - 1%; Part Description: General Purpose Thick Film Chip Resistor; Manufacturer: GENERIC; Manufacturer1 Part Number: NRC06F1101TRF; Power: 0.1W; TC: ±100ppm/°C; PressFit: No; Part Number: R0603_1K1_1%_0.1W_100PPM; Component Kind: Standard; Component Type: Standard; Pin Count: 2; Value: 1k1; Status: Preferred; Tolerance: ±1%; Manufacturer Part Number: R0603_1K1_1%_0.1W_100PPM; Case: 0603; Mounted: Yes; Sense: No; Socket: No; SMD: Yes; Manufacturer1 Example: NIC COMPONENT; Manufacturer1 ComponentHeight: 0.55mm; HelpURL: \\cern.ch\dfs\Applications\Altium\Datasheets\R0603_NIC_NRC.pdf; Author: CERN DEM JLC; CreateDate: 03.12.2007; LatestRevisionDate: 13.03.2008
R29 = R0603_150R_1%_0.1W_100PPM: Resistor - 1%; Part Description: General Purpose Thick Film Chip Resistor; Manufacturer: GENERIC; Manufacturer1 Part Number: NRC06F1500TRF; Power: 0.1W; TC: ±100ppm/°C; PressFit: No; Part Number: R0603_150R_1%_0.1W_100PPM; Component Kind: Standard; Component Type: Standard; Pin Count: 2; Value: 150; Status: Preferred; Tolerance: ±1%; Manufacturer Part Number: R0603_150R_1%_0.1W_100PPM; Case: 0603; Mounted: Yes; Sense: No; Socket: No; SMD: Yes; Manufacturer1 Example: NIC COMPONENT; Manufacturer1 ComponentHeight: 0.55mm; HelpURL: \\cern.ch\dfs\Applications\Altium\Datasheets\R0603_NIC_NRC.pdf; Author: CERN DEM JLC; CreateDate: 03.12.2007; LatestRevisionDate: 13.03.2008
R30 = R1206_2R_1%_0.25W_200PPM: Resistor - 1%; Part Description: General Purpose Thick Film Chip Resistor; Manufacturer: GENERIC; Manufacturer1 Part Number: 232272462008L or RC1206FR-072RL; Power: 0.25W; TC: ±200ppm/°C; PressFit: No; Part Number: R1206_2R_1%_0.25W_200PPM; Component Kind: Standard; Component Type: Standard; Pin Count: 2; Value: 2; Status: Preferred; Tolerance: ±1%; Manufacturer Part Number: R1206_2R_1%_0.25W_200PPM; Case: 1206; Mounted: Yes; Sense: No; Socket: No; SMD: Yes; Manufacturer1 Example: YAGEO PHYCOMP; Manufacturer1 ComponentHeight: 0.65mm; HelpURL: \\cern.ch\dfs\Applications\Altium\Datasheets\R1206_Phycomp_RC1206.pdf; Author: CERN DEM JLC; CreateDate: 03.12.2007; LatestRevisionDate: 17.10.2012
SW0 = B13AP: Switch;  Sealed;  Anti-Static Toggle;  SPDT;  ON-OFF-ON;  Str PC;  No Cap;  0.4A;  28VAC/DC; Manufacturer 1: NKK Switches; Actuator Material: Brass; Voltage Rating (AC): 28V; Current Rating: 100mA; Power Rating: 400mW; Illumination Type: Non-Illuminated,Illuminated; Electrical Life: 50000Cycles; Actuator Type: Standard Round; Actuator Length: 10mm; Supplier 1: Digi-Key; Manufacturer Part Number 1: B13AP; Stock 1: 542; Pricing 1: 1=3,70000, 10=3,31100, 25=3,14160, 50=2,98760, 100=2,84900, 250=2,72580, 500=2,49480, 1000=2,37160 (USD); RoHS: Yes; Mount: Through Hole,PCB; Number of Pins: 1; Contact Plating: Gold; Contact Material: Bronze,Gold; Min Operating Temperature: -30°C; Max Operating Temperature: 85°C; Throw Configuration: SPDT; Packaging: Bulk; Voltage Rating (DC): 28V; Orientation: Vertical; Package Quantity: 1; Switch Function: On-Off-On; Termination: Solder; Max Current Rating: 100mA; Max Voltage Rating (AC): 28V; Max Voltage Rating (DC): 28V; Contact Current Rating: 100mA; Length: 8.8mm; Depth: 6.8mm; Lead Free: Lead Free; REACH SVHC: No SVHC; ComponentLink1URL: https://datasheet.ciiva.com/5287/btoggles-28447-5287190.pdf?src-supplier=Mouser; ComponentLink1Description: https://datasheet.ciiva.com/5287/btoggles-28447-5287190.pdf?src-supplier=Mouser; ComponentLink2URL: https://datasheet.ciiva.com/14542/70192333-14542216.pdf?src-supplier=Allied+Electronics; ComponentLink2Description: https://datasheet.ciiva.com/14542/70192333-14542216.pdf?src-supplier=Allied+Electronics; Supplier Part Number 1: 360-1013-ND
TP12-TP17 = SMD_PAD_1.27X1.27MM: Part Description: 1.27mm x 1.27mm PCB Copper Area (SMD Test Point); Mounted: No; Part Number: SMD_PAD_1.27X1.27MM; Component Kind: Standard (No BOM); Component Type: Standard (No BOM); Pin Count: 1; Family: Test Point; Socket: No; SMD: Yes; Sense: No; Status: None; ComponentHeight: 0mm; HelpURL: Undefined; Author: CERN DEM JLC; CreateDate: 12.01.2008; LatestRevisionDate: 12.01.2008; PackageDescription: 1.27mm x 1.27mm PCB Copper Area (SMD Test Point)